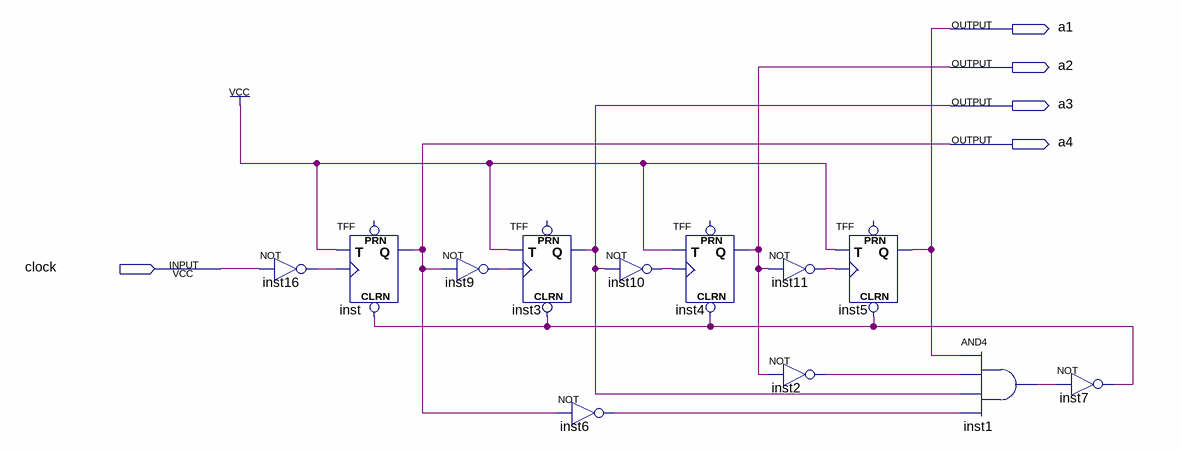
[diagram p0: schematic sheet]
// Quartus schematic OneDigitCounter2.bdf as structural Verilog: 12 symbols, 5 pins
module OneDigitCounter2 (
  input  clock,
  output a1,
  output a2,
  output a3,
  output a4
);

  wire inst1_out, inst2_out, inst6_out, inst7_out, inst9_out, inst10_out, inst11_out, inst16_out;

  not inst16 (inst16_out, clock);
  TFF inst (.CLRN(inst7_out), .T(1'b1), .CLK(inst16_out), .Q(a4));  // open: PRN
  not inst9 (inst9_out, a4);
  TFF inst3 (.CLRN(inst7_out), .T(1'b1), .CLK(inst9_out), .Q(a3));  // open: PRN
  not inst6 (inst6_out, a4);
  not inst10 (inst10_out, a3);
  TFF inst4 (.CLRN(inst7_out), .T(1'b1), .CLK(inst10_out), .Q(a2));  // open: PRN
  not inst11 (inst11_out, a2);
  not inst2 (inst2_out, a2);
  TFF inst5 (.CLRN(inst7_out), .T(1'b1), .CLK(inst11_out), .Q(a1));  // open: PRN
  and inst1 (inst1_out, a1, inst2_out, a3, inst6_out);
  not inst7 (inst7_out, inst1_out);
endmodule
